# Altium project MAB17.PrjPcb
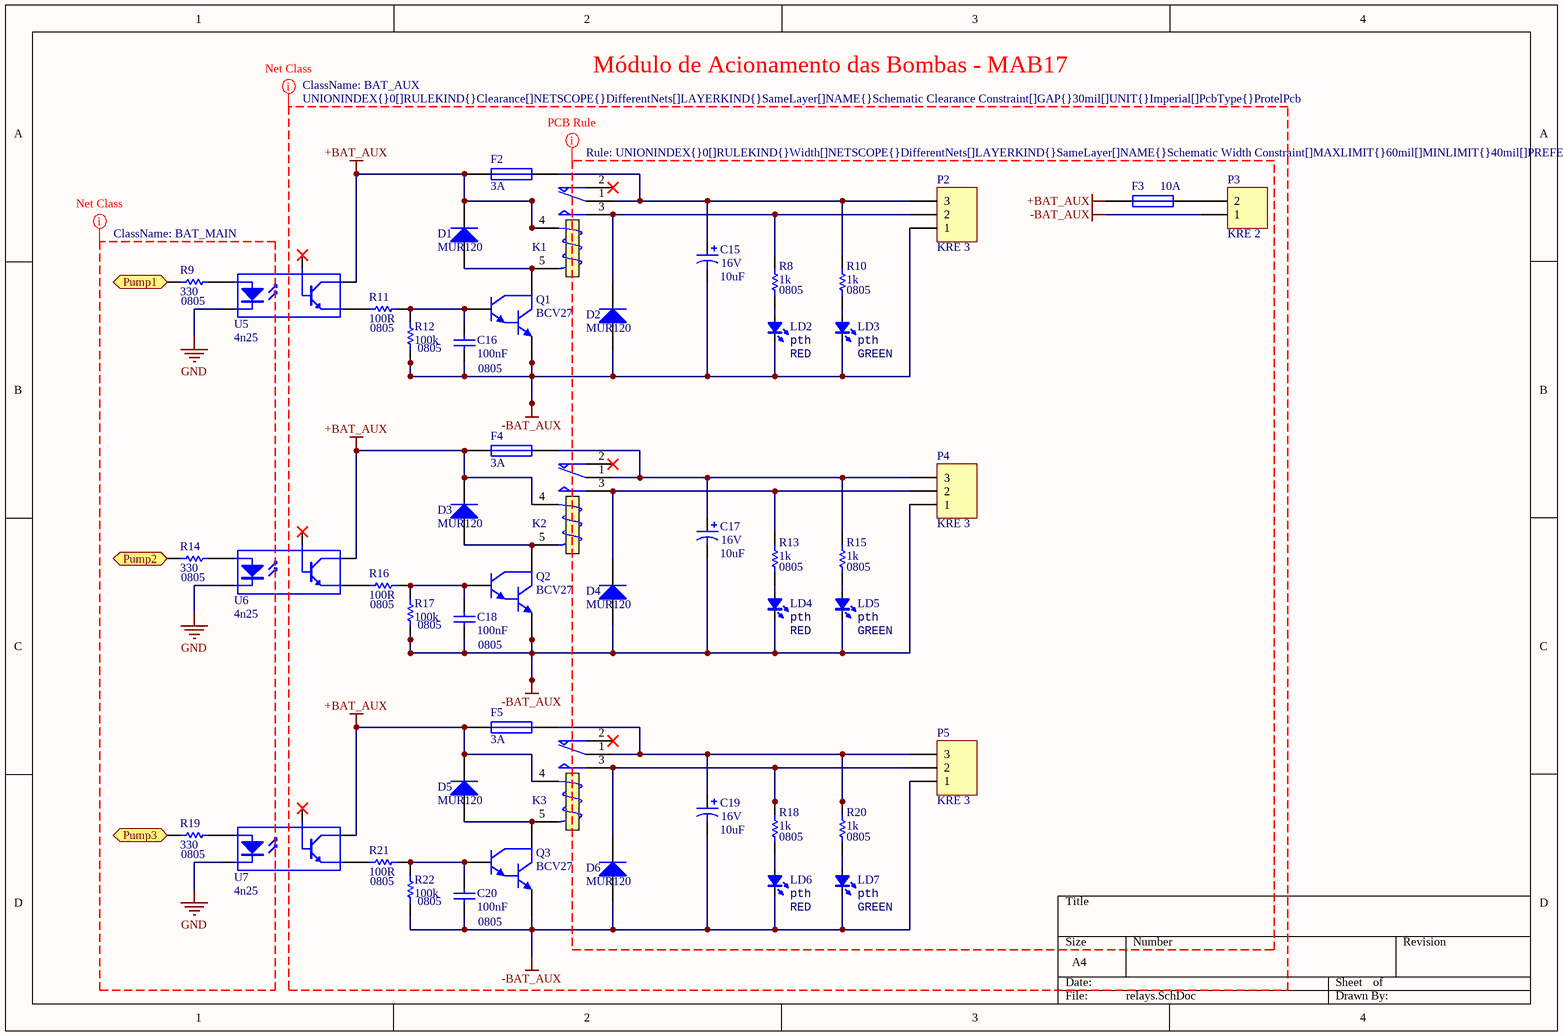
[diagram p0: relays.SchDoc]
2 sheets, 83 parts. Net scope: flat (ports and power ports of the same name join across sheets).
Board files: MAB17_sem_malha.PcbDoc, MAB17.PcbDoc, MAB17-panel.PcbDoc
Sheets:
  relays.SchDoc
  atmega.SchDoc

## Sheet relays.SchDoc
size A4

### Parts
C15  Voltage: 16V  [cap10uF16V]  (hidden comment: 10uF)
C16  100nF  Footprint: 0805  [0805C]
C17  Voltage: 16V  [cap10uF16V]  (hidden comment: 10uF)
C18  100nF  Footprint: 0805  [0805C]
C19  Voltage: 16V  [cap10uF16V]  (hidden comment: 10uF)
C20  100nF  Footprint: 0805  [0805C]
D1  MUR120  [DIO10.2-7x2.7]
D2  MUR120  [DSO-C2/X2.3]
D3  MUR120  [DIO10.2-7x2.7]
D4  MUR120  [DSO-C2/X2.3]
D5  MUR120  [DIO10.2-7x2.7]
D6  MUR120  [DSO-C2/X2.3]
F2  3A  [Porta Fusivel]
F3  10A  [Porta Fusivel]
F4  3A  [Porta Fusivel]
F5  3A  [Porta Fusivel]
K1  (no value)  [RELE]
K2  (no value)  [RELE]
K3  (no value)  [RELE]
LD2  Type: pth  [LED3MM]  (hidden comment: RED)
LD3  Type: pth  [LED3MM]  (hidden comment: GREEN)
LD4  Type: pth  [LED3MM]  (hidden comment: RED)
LD5  Type: pth  [LED3MM]  (hidden comment: GREEN)
LD6  Type: pth  [LED3MM]  (hidden comment: RED)
LD7  Type: pth  [LED3MM]  (hidden comment: GREEN)
P2  KRE 3  [KRE_3]
P3  KRE 2  [KRE_2]
P4  KRE 3  [KRE_3]
P5  KRE 3  [KRE_3]
Q1  BCV27  [SOT95P240-3N]
Q2  BCV27  [SOT95P240-3N]
Q3  BCV27  [SOT95P240-3N]
R8  1k  Type: 0805  [0805R]
R9  330  Type: 0805  [0805R]
R10  1k  Type: 0805  [0805R]
R11  100R  Type: 0805  [0805R]
R12  100k  Type: 0805  [0805R]
R13  1k  Type: 0805  [0805R]
R14  330  Type: 0805  [0805R]
R15  1k  Type: 0805  [0805R]
R16  100R  Type: 0805  [0805C]
R17  100k  Type: 0805  [0805C]
R18  1k  Type: 0805  [0805R]
R19  330  Type: 0805  [0805R]
R20  1k  Type: 0805  [0805R]
R21  100R  Type: 0805  [0805C]
R22  100k  Type: 0805  [0805C]
U5  4n25  [SMD-6]
U6  4n25  [SMD-6]
U7  4n25  [SMD-6]

### Ports
Pump1 (in), Pump2 (in), Pump3 (in)

### Nets
+BAT_AUX: D1.2(K) D3.2(K) D5.2(K) F2.2 F3.2 F4.2 F5.2 K1.4(T1) K2.4(T1) K3.4(T1) U5.5(C) U6.5(C) U7.5(C)
-BAT_AUX: C15.2 C16.1 C17.2 C18.1 C19.2 C20.1 D2.1(A) D4.1(A) D6.1(A) LD2.2(K) LD3.2(K) LD4.2(K) LD5.2(K) LD6.2(K) LD7.2(K) P2.1 P3.1 P4.1 P5.1 Q1.3(E) Q2.3(E) Q3.3(E) R12.1 R17.1 R22.1
GND: U5.3(K) U6.3(K) U7.3(K)  [project net CAN_GND]
NetC15_1: C15.1 F2.1 K1.1(COM) P2.3 R10.2
NetC16_2: C16.2 Q1.2(B) R11.1 R12.2
NetC17_1: C17.1 F4.1 K2.1(COM) P4.3 R15.2
NetC18_2: C18.2 Q2.2(B) R16.1 R17.2
NetC19_1: C19.1 F5.1 K3.1(COM) P5.3 R20.2
NetC20_2: C20.2 Q3.2(B) R21.1 R22.2
NetD1_1: D1.1(A) K1.5(T2) Q1.1(C)
NetD2_2: D2.2(K) K1.3(NO) P2.2 R8.2
NetD3_1: D3.1(A) K2.5(T2) Q2.1(C)
NetD4_2: D4.2(K) K2.3(NO) P4.2 R13.2
NetD5_1: D5.1(A) K3.5(T2) Q3.1(C)
NetD6_2: D6.2(K) K3.3(NO) P5.2 R18.2
NetF3_1: F3.1 P3.2
NetLD2_1: LD2.1(A) R8.1
NetLD3_1: LD3.1(A) R10.1
NetLD4_1: LD4.1(A) R13.1
NetLD5_1: LD5.1(A) R15.1
NetLD6_1: LD6.1(A) R18.1
NetLD7_1: LD7.1(A) R20.1
NetR9_1: R9.1 ; port Pump1
NetR9_2: R9.2 U5.1(A)
NetR11_2: R11.2 U5.4(E)
NetR14_1: R14.1 ; port Pump2
NetR14_2: R14.2 U6.1(A)
NetR16_2: R16.2 U6.4(E)
NetR19_1: R19.1 ; port Pump3
NetR19_2: R19.2 U7.1(A)
NetR21_2: R21.2 U7.4(E)

Not connected (* = marked no-connect by the designer): K1 2(NC)*; K2 2(NC)*; K3 2(NC)*; U5 6(B)*; U6 6(B)*; U7 6(B)*

### Layout directives
net class BAT_AUX; rule Clearance Constraint [Clearance = 30mil]: +BAT_AUX, -BAT_AUX
net class BAT_MAIN: GND
rule Width Constraint [Pref Width = 50mil    Min Width = 40mil    Max Width = 60mil]: +BAT_AUX, -BAT_AUX

### Notes on the sheet
- Módulo de Acionamento das Bombas - MAB17

### Library data of the parts
C15 C17 C19 = Cap Pol1: Polarized Capacitor (Radial); Type: pth; PackageReference: RB7.6-15; Value: 10uF
C16 C18 C20 = Cap: Capacitor; Voltage: 25V; Type: pth; PackageReference: RAD-0.3; Value: 100nF
D1-D6 = Diode: Default Diode; Type: pth; PackageReference: SMC; Value: MUR120
F2-F5 = Fuse 1: Fuse 5x20; PackageReference: PIN-W2/E2.8; Type: 5x20
  F2 F4 F5: Value: 3A
  F3: Value: 10A
K1-K3 = Relay: SPDT Relay; PackageReference: MODULE5B
LD2-LD7 = LED_0805: LED
  LD2 LD4 LD6: Value: RED
  LD3 LD5 LD7: Value: GREEN
P2 P4 P5 = Header 3: Header, 3-Pin; Type: KRE; Value: KRE 3
P3 = KRE_2: Terminal Block 1x2; Type: KRE; Value: KRE 2
Q1-Q3 = NPN1: NPN Darlington Bipolar Transistor; Type: TO-92; PackageReference: TO-92; Value: BCV27
R8-R22 = Res1: Resistor
  R8 R10 R13 R15 R18 R20: PackageReference: AXIAL-0.3; Value: 1k
  R9 R14 R19: PackageReference: AXIAL-0.3; Value: 330
  R11 R21: Value: 100R
  R12 R17 R22: Value: 100k
  R16: PackageReference: AXIAL-0.3; Value: 100R
U5-U7 = Optoisolator2: 5 Pin Mini Flat Pack Optocoupler; pin to pad: 3>2; PackageReference: SOP5(6); Type: SOP5(6); Value: 4n25

## Sheet atmega.SchDoc
size A4
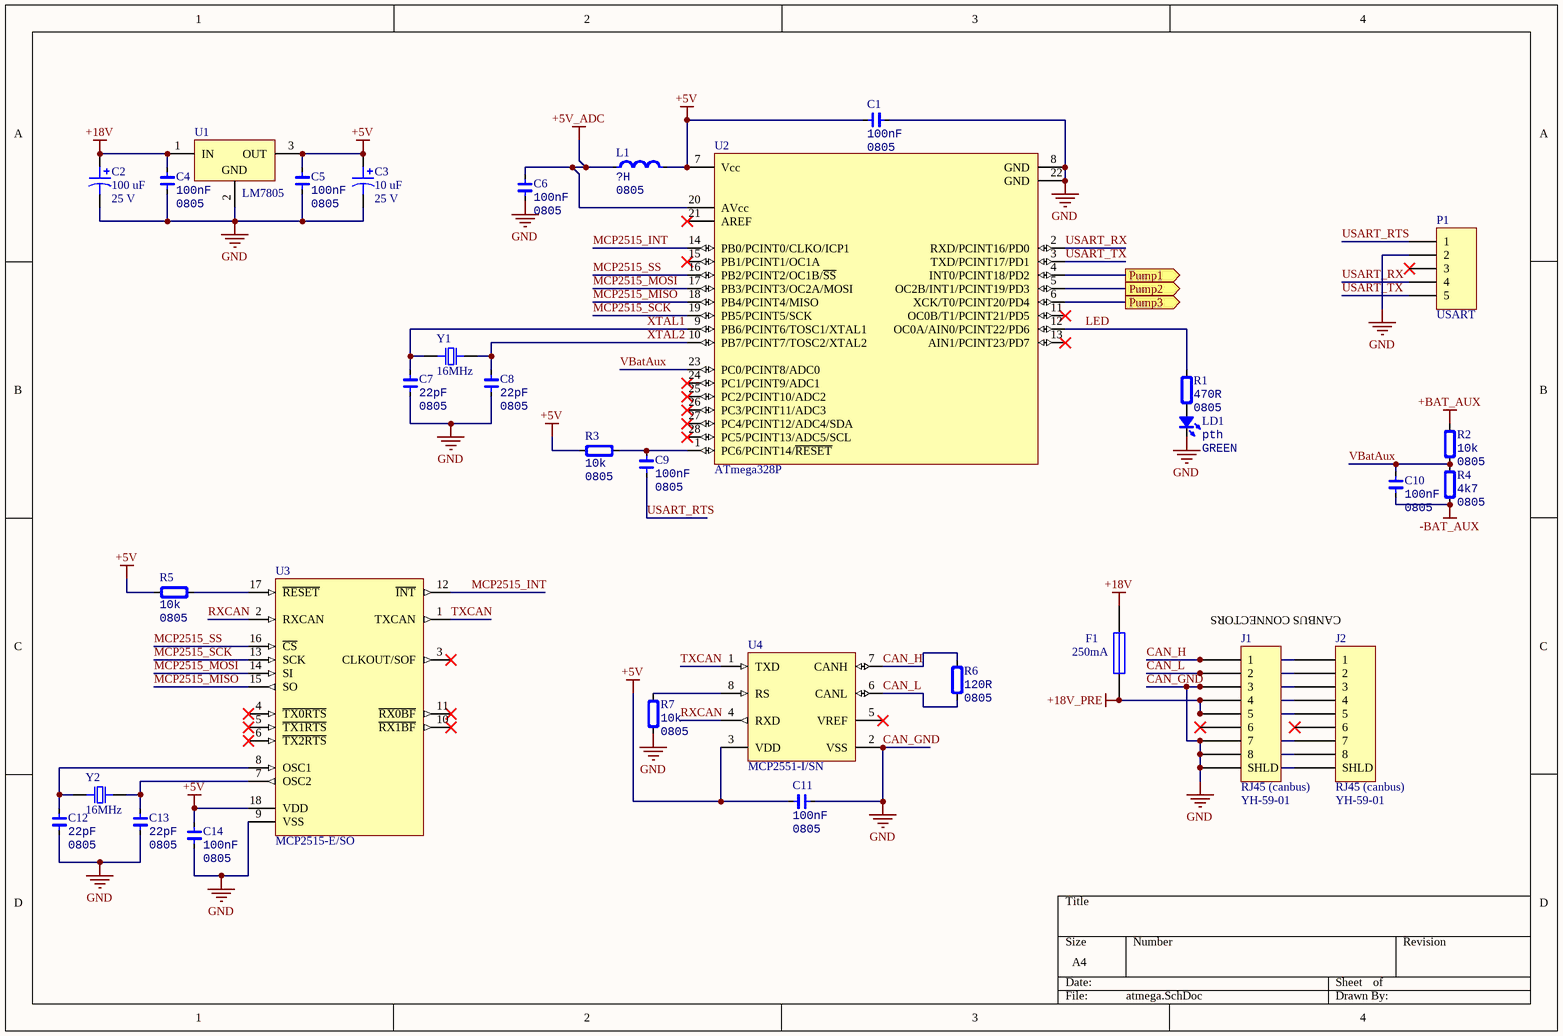
[diagram p1: atmega.SchDoc]

### Parts
C1  Type: 0805  [0805C]  (hidden comment: 100nF)
C2  Voltage: 25 V  [CP3.5mm-8.0mm]  (hidden comment: 100 uF)
C3  Voltage: 25 V  [CP3.5mm-8.0mm]  (hidden comment: 10 uF)
C4  Type: 0805  [0805C]  (hidden comment: 100nF)
C5  Type: 0805  [0805C]  (hidden comment: 100nF)
C6  Type: 0805  [0805C]  (hidden comment: 100nF)
C7  Type: 0805  [0805C]  (hidden comment: 22pF)
C8  Type: 0805  [0805C]  (hidden comment: 22pF)
C9  Type: 0805  [0805C]  (hidden comment: 100nF)
C10  Type: 0805  [0805C]  (hidden comment: 100nF)
C11  Type: 0805  [0805C]  (hidden comment: 100nF)
C12  Type: 0805  [0805C]  (hidden comment: 22pF)
C13  Type: 0805  [0805C]  (hidden comment: 22pF)
C14  Type: 0805  [0805C]  (hidden comment: 100nF)
F1  250mA  [Porta Fusivel]
J1  RJ45 (canbus)  value YH-59-01  [ASSMANN A-2004-2-4-LP/FS]
J2  RJ45 (canbus)  value YH-59-01  [ASSMANN A-2004-2-4-LP/FS]
L1  Type: 0805  [0805L]  (hidden comment: ?H)
LD1  Type: pth  [LED3MM]  (hidden comment: GREEN)
P1  USART  [HDR1X5]
R1  Type: 0805  [0805R]  (hidden comment: 470R)
R2  Type: 0805  [0805R]  (hidden comment: 10k)
R3  Type: 0805  [0805R]  (hidden comment: 10k)
R4  Type: 0805  [0805R]  (hidden comment: 4k7)
R5  Type: 0805  [0805R]  (hidden comment: 10k)
R6  Type: 0805  [0805R]  (hidden comment: 120R)
R7  Type: 0805  [0805R]  (hidden comment: 10k)
U1  LM7805  [TO220_deitado]
U2  ATmega328P  [DIP28-300(100)]
U3  MCP2515-E/SO  [WSO18_L]
U4  MCP2551-I/SN  [SOIC08-150(50)]
Y1  16MHz  [HC49-US-THT]
Y2  16MHz  [HC49-US-THT]

### Ports
Pump1 (out), Pump2 (out), Pump3 (out)

### Nets
+5V: C1.1 C3.1 C5.2 C11.1 C14.1 L1.2 R3.1 R5.1 U1.3(OUT) U2.7(Vcc) U3.18(VDD) U4.3(VDD)
+5V_ADC: C6.2 L1.1 U2.20(AVcc)
+18V: C2.1 C4.2 F1.1 U1.1(IN)
+18V_PRE: F1.2 J1.4 J1.5 J2.4 J2.5
+BAT_AUX: R2.2
-BAT_AUX: C10.1 R4.1
CAN_GND: C1.2 C2.2 C3.2 C4.1 C5.1 C6.1 C7.1 C8.1 C11.2 C12.1 C13.1 C14.2 J1.3 J1.7 J1.8 J1.S(SHLD) J2.3 J2.7 J2.8 J2.S(SHLD) LD1.2(K) P1.2 R7.2 U1.2(GND) U2.8(GND) U2.22(GND) U3.9(VSS) U4.2(VSS)  [also labelled GND]
CAN_H: J1.1 J2.1 R6.2 U4.7(CANH)
CAN_L: J1.2 J2.2 R6.1 U4.6(CANL)
LED: R1.2 U2.12(OC0A/AIN0/PCINT22/PD6)
MCP2515_INT: U2.14(PB0/PCINT0/CLKO/ICP1) U3.12(~{INT})
MCP2515_MISO: U2.18(PB4/PCINT4/MISO) U3.15(SO)
MCP2515_MOSI: U2.17(PB3/PCINT3/OC2A/MOSI) U3.14(SI)
MCP2515_SCK: U2.19(PB5/PCINT5/SCK) U3.13(SCK)
MCP2515_SS: U2.16(PB2/PCINT2/OC1B/~{SS}) U3.16(~{CS})
RXCAN: U3.2(RXCAN) U4.4(RXD)
TXCAN: U3.1(TXCAN) U4.1(TXD)
USART_RTS: C9.2 P1.1
USART_RX: P1.4 U2.2(RXD/PCINT16/PD0)
USART_TX: P1.5 U2.3(TXD/PCINT17/PD1)
VBatAux: C10.2 R2.1 R4.2 U2.23(PC0/PCINT8/ADC0)
XTAL1: C7.2 U2.9(PB6/PCINT6/TOSC1/XTAL1) Y1.1
XTAL2: C8.2 U2.10(PB7/PCINT7/TOSC2/XTAL2) Y1.2
NetC9_1: C9.1 R3.2 U2.1(PC6/PCINT14/~{RESET})
NetC12_2: C12.2 U3.8(OSC1) Y2.1
NetC13_2: C13.2 U3.7(OSC2) Y2.2
NetLD1_1: LD1.1(A) R1.1
NetR5_2: R5.2 U3.17(~{RESET})
NetR7_1: R7.1 U4.8(RS)
NetR9_1: U2.4(INT0/PCINT18/PD2) ; port Pump1
NetR14_1: U2.5(OC2B/INT1/PCINT19/PD3) ; port Pump2
NetR19_1: U2.6(XCK/T0/PCINT20/PD4) ; port Pump3

Not connected (* = marked no-connect by the designer): J1 6*; J2 6*; P1 3*; U2 11(OC0B/T1/PCINT21/PD5)* 13(AIN1/PCINT23/PD7)* 15(PB1/PCINT1/OC1A)* 21(AREF)* 24(PC1/PCINT9/ADC1)* 25(PC2/PCINT10/ADC2)* 26(PC3/PCINT11/ADC3)* 27(PC4/PCINT12/ADC4/SDA)* 28(PC5/PCINT13/ADC5/SCL)*; U3 3(CLKOUT/SOF)* 4(~{TX0RTS})* 5(~{TX1RTS})* 6(~{TX2RTS})* 10(~{RX1BF})* 11(~{RX0BF})*; U4 5(VREF)*

### Notes on the sheet
- CANBUS CONNECTORS

### Library data of the parts
C1 C4-C14 = Cap_0805: Capacitor
  C1 C4-C6 C9-C11 C14: Value: 100nF
  C7 C8 C12 C13: Value: 22pF
C2 C3 = CapacitorPol: Solid Aluminum Capacitor with Organic Semiconductor Electrolyte: 100uF, 10V, Bulk Pack; PackageReference: E
  C2: Value: 100 uF
  C3: Value: 10 uF
F1 = Fuse 1: Fuse; Type: 5x20; PackageReference: PIN-W2/E2.8; Value: 250mA
J1 J2 = Modular Jack with Shield: YH-59-01; Type: RJ45
L1 = Ind_0805: Inductor; Value: ?H
LD1 = LED_0805: LED; Value: GREEN
P1 = Header 5: Header, 5-Pin; Type: KRE
R1-R7 = Res_0805: Resistor
  R1: Value: 470R
  R2 R3 R5 R7: Value: 10k
  R4: Value: 4k7
  R6: Value: 120R
U1 = µA7805CKC: Positive-Voltage Regulator; PackageReference: KC03
U2 = ATmega328P: 8-bit AVR Microcontroller, 32KB Flash, 1KB EEPROM, 2KB SRAM, 28-pin PDIP, Industrial Grade (-40°C to 85°C); PackageReference: 28P3
U3 = CMP-0186-00035-2: Stand-Alone CAN Controller With SPI Interface, 18-Pin SOIC, Extended Temperature; PackageReference: SOIC-SO18; Type: SOIC-SO18; Value: MCP2515-E/SO
U4 = CMP-1721-00003-1: PackageReference: SN8; Type: SN8; Value: MCP2551-I/SN
Y1 Y2 = Crystal: Type: pth; Value: 16MHz

## Nets that join several sheets
+BAT_AUX: relays (13 pins), atmega (R2.2)
-BAT_AUX: relays (25 pins), atmega (C10.1 R4.1)
CAN_GND: relays (U5.3 U6.3 U7.3), atmega (28 pins)
NetR9_1: relays (R9.1), atmega (U2.4)
NetR14_1: relays (R14.1), atmega (U2.5)
NetR19_1: relays (R19.1), atmega (U2.6)